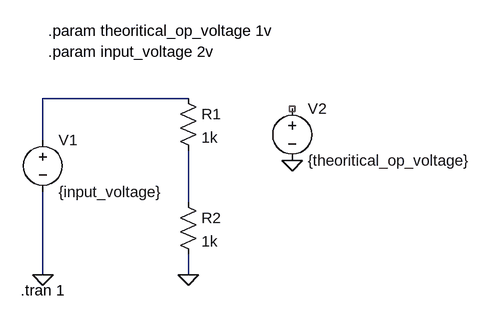
[diagram p0: schematic Draft1.asc]
Draft1.asc, the LTspice schematic file:
Version 4
SHEET 1 880 680
WIRE 256 64 32 64
WIRE 32 128 32 64
WIRE 256 224 256 144
WIRE 32 336 32 208
WIRE 256 336 256 304
FLAG 32 336 0
FLAG 256 336 0
FLAG 416 160 0
SYMBOL voltage 32 112 R0
WINDOW 123 0 0 Left 0
WINDOW 39 0 0 Left 0
SYMATTR InstName V1
SYMATTR Value {input_voltage}
SYMBOL res 240 48 R0
SYMATTR InstName R1
SYMATTR Value 1k
SYMBOL res 240 208 R0
SYMATTR InstName R2
SYMATTR Value 1k
SYMBOL voltage 416 64 R0
WINDOW 123 0 0 Left 0
WINDOW 39 0 0 Left 0
SYMATTR InstName V2
SYMATTR Value {theoritical_op_voltage}
TEXT 40 -8 Left 2 !.param input_voltage 2v
TEXT 40 -40 Left 2 !.param theoritical_op_voltage 1v
TEXT -2 360 Left 2 !.tran 1

The netlist it stands for:
* Draft1.asc
V1 N001 0 {input_voltage}
R1 N001 N002 1k
R2 N002 0 1k
V2 NC_01 0 {theoritical_op_voltage}
.param input_voltage 2v
.param theoritical_op_voltage 1v
.tran 1
.backanno
.end